# Altium schematic sheet RANGE-FINDER-NODE-SCH.SchDoc: RANGE FINDER NODE
size A; Engineer: Ehsan Shaghaei; SheetNumber: 1; SheetTotal: 4
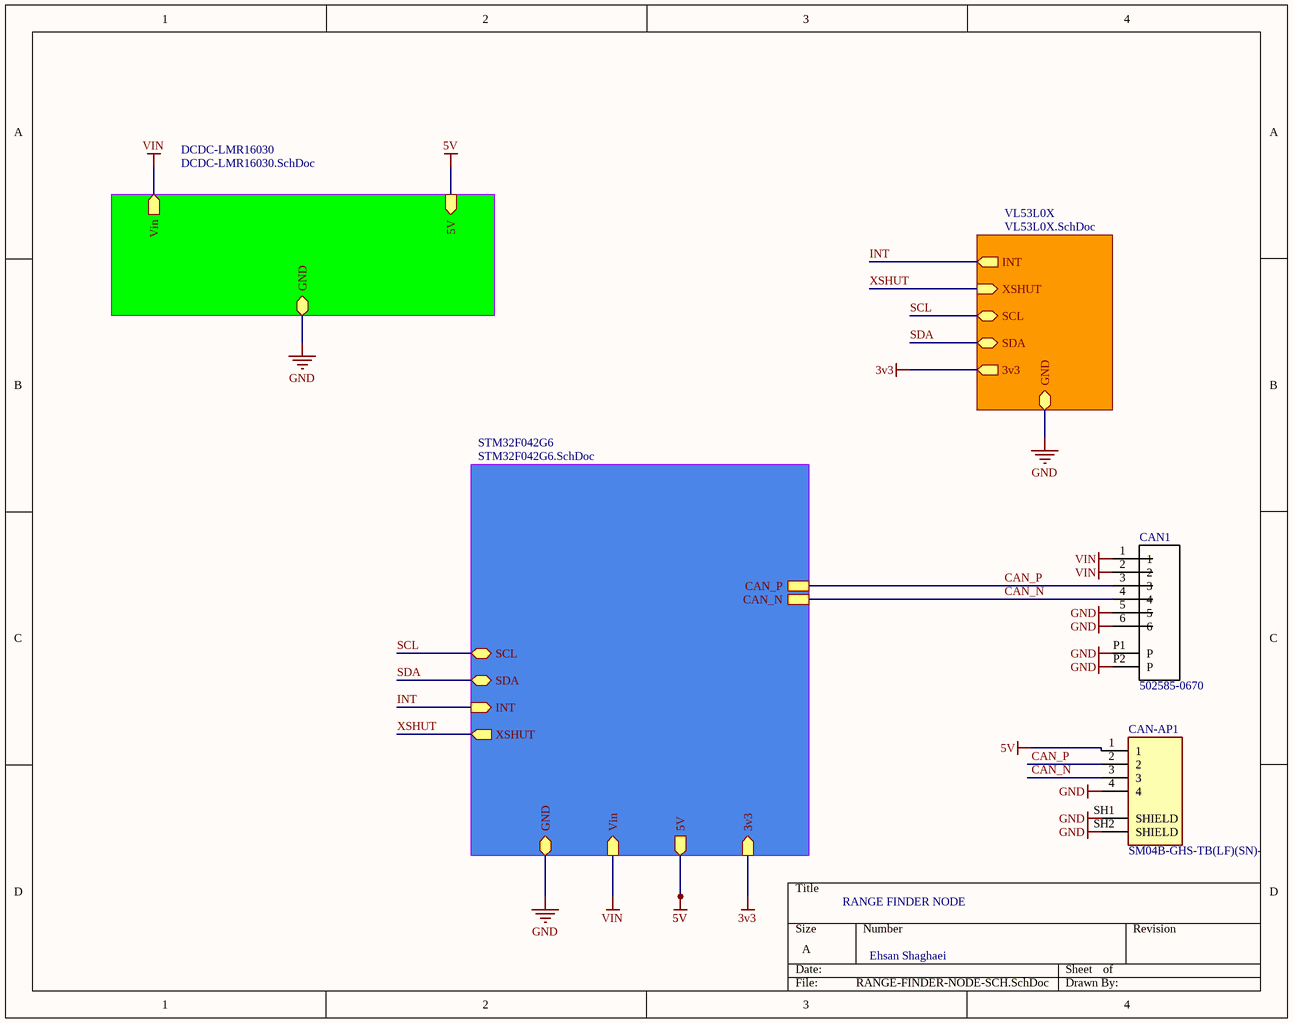
[diagram p0: RANGE-FINDER-NODE-SCH.SchDoc]

## Parts
CAN1  502585-0670  [MOLEX_502585-0670]
CAN-AP1  SM04B-GHS-TB(LF)(SN)-  [JST_SM04B-GHS-TB(LF)(SN)-]

## Sub-sheets
DCDC-LMR16030 = DCDC-LMR16030.SchDoc: GND (bidir), Vin (out), 5V (in)
STM32F042G6 = STM32F042G6.SchDoc: GND (bidir), Vin (in), 5V (out), 3v3 (in), SDA (bidir), SCL (bidir), XSHUT (out), INT (in), CAN_P, CAN_N
VL53L0X = VL53L0X.SchDoc: GND (bidir), 3v3 (out), SDA (bidir), SCL (bidir), XSHUT (in), INT (out)

## Nets
3v3: sheet STM32F042G6/3v3, sheet VL53L0X/3v3
5V: CAN-AP1.1 ; sheet STM32F042G6/5V, sheet DCDC-LMR16030/5V
GND: CAN1.5 CAN1.6 CAN1.P1(P) CAN1.P2(P) CAN-AP1.4 CAN-AP1.SH1(SHIELD) CAN-AP1.SH2(SHIELD) ; sheet STM32F042G6/GND, sheet DCDC-LMR16030/GND, sheet VL53L0X/GND
VIN: CAN1.1 CAN1.2 ; sheet STM32F042G6/Vin, sheet DCDC-LMR16030/Vin
CAN_N: CAN1.4 CAN-AP1.3 ; sheet STM32F042G6/CAN_N
CAN_P: CAN1.3 CAN-AP1.2 ; sheet STM32F042G6/CAN_P
INT: sheet STM32F042G6/INT, sheet VL53L0X/INT
SCL: sheet STM32F042G6/SCL, sheet VL53L0X/SCL
SDA: sheet STM32F042G6/SDA, sheet VL53L0X/SDA
XSHUT: sheet STM32F042G6/XSHUT, sheet VL53L0X/XSHUT

## Library data of the parts
CAN1 = 502585-0670: 1.50mm Pitch, CLIK-Mate PCB Receptacle, Single Row, Surface Mount, Right-Angle, Tin Plating, Positive Lock, 6 Circuits, Natural; MF: Molex; System: Connector; MP: 502585-0670; Package: None; SnapEDA_Link: https://www.snapeda.com/parts/502494-0670/Molex/view-part/?ref=snap; Value: *; Type: SMD
CAN-AP1 = SM04B-GHS-TB(LF)(SN)-: Connector Header Surface Mount, Right Angle 4 position 0.049 _1.25mm_; MF: JST Sales; MP: SM04B-GHS-TB(LF)(SN); Package: None; Value: *; SnapEDA_Link: https://www.snapeda.com/parts/SM04B-GHS-TB%28LF%29%28SN%29-/JST%20Sales%20America%20Inc./view-part/2759740/?ref=snap; HelpURL: http://www.farnell.com/datasheets/2082975.pdf; System: Connector; ChipDip_Link: https://www.chipdip.ru/product/sm04b-ghs-tb-lf-sn-gh-1.25mm-header-side-ent